# EAGLE schematic 10MHzRefOsc_2V1 (EAGLE 7.7.0)
DF4IAH - 10 MHz Reference Oscillator

## Sheet 1 of 3: Main
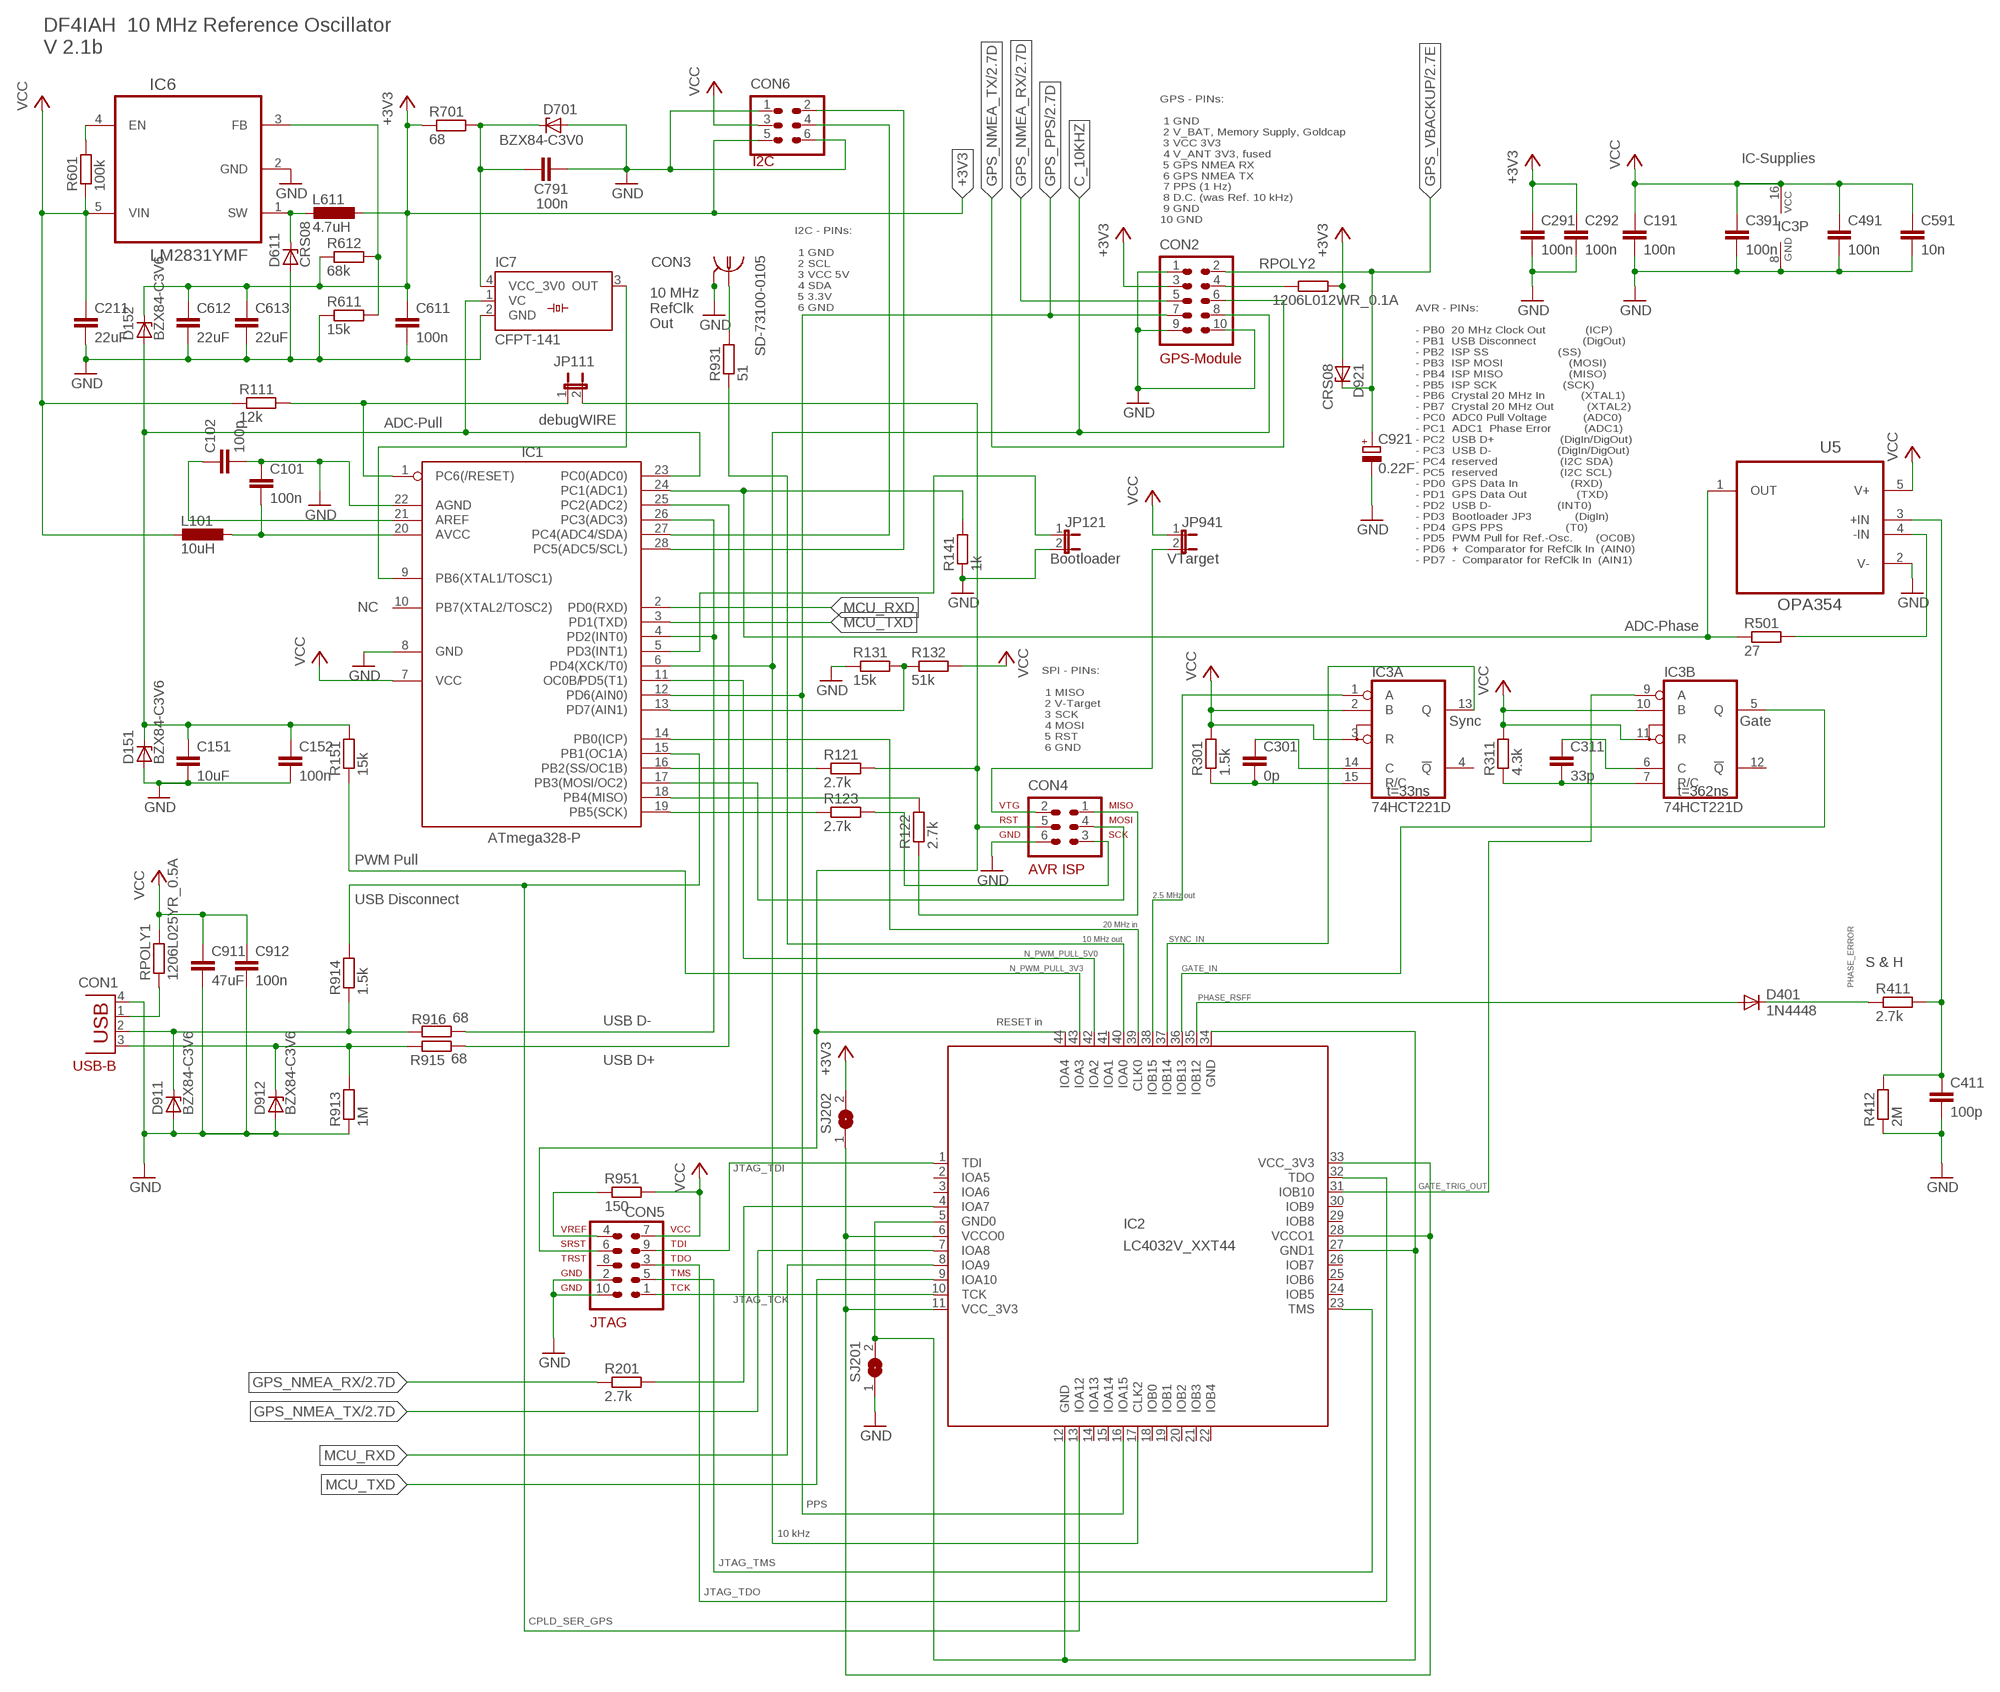
[diagram p0: schematic, sheet 1]

### Parts
C101  100n  C-EUC0805  [C0805]
C102  100p  C-EUC0805  [C0805]
C151  10uF  C-EUC0805  [C0805]
C152  100n  C-EUC0805  [C0805]
C191  100n  C-EUC0805  [C0805]
C211  22uF  C-EUC0805  [C0805]
C291  100n  C-EUC0805  [C0805]
C292  100n  C-EUC0805  [C0805]
C301  0p  C-EUC0805  [C0805]
C311  33p  C-EUC0805  [C0805]
C391  100n  C-EUC0805  [C0805]
C411  100p  C-EUC0805  [C0805]
C491  100n  C-EUC0805  [C0805]
C591  10n  C-EUC0805  [C0805]
C611  100n  C-EUC0805  [C0805]
C612  22uF  C-EUC0805  [C0805]
C613  22uF  C-EUC0805  [C0805]
C791  100n  C-EUC0805  [C0805]
C911  47uF  C-EUC0805  [C0805]
C912  100n  C-EUC0805  [C0805]
C921  0.22F  CPOL-EU140CLH-1010  [140CLH-1010]
CON1  TYCO-AMP_USBUSB-B_SMT  [TYCO-AMP_USB-B_SMT]
CON2  HEADER-2X5SMD  [2X5SMD]
CON3  SD-73100-0105  MOLEX_BNC-JACK-50R_SD-73100-0105  [MOLEX_BNC-JACK-50R_SD-73100-0105]
CON4  AVR-ISP-6SMD  [2X3SMD]
CON5  AVR-JTAG-10SMD  [2X5SMD]
CON6  HEADER-2X3SMD  [2X03SMD]
D151  BZX84-C3V6  BZX84CSMD  [TO236]
D152  BZX84-C3V6  BZX84CSMD  [TO236]
D401  1N4448  DIODE-SOD123  [SOD123]
D611  CRS08  ZENER-DIODESOD80C  [SOD80C]
D701  BZX84-C3V0  BZX84CSMD  [TO236]
D911  BZX84-C3V6  BZX84CSMD  [TO236]
D912  BZX84-C3V6  BZX84CSMD  [TO236]
D921  CRS08  ZENER-DIODESOD80C  [SOD80C]
IC1  ATmega328-P  MEGA8-P  [DIL28-3]
IC2  LC4032V_XXT44  [TQFP44]
IC3  74HCT221D  [SO16]
IC6  LM2831YMF  [SOT95P280X145-5N]
IC7  CFPT-141  [CFPT-141]
JP111  JP1E  [JP1]
JP121  JP1E  [JP1]
JP941  JP1E  [JP1]
L101  10uH  L-EUL1812  [L1812]
L611  4.7uH  L-EUL5650M  [L5650M]
R111  12k  R-EU_R0805  [R0805]
R121  2.7k  R-EU_R0805  [R0805]
R122  2.7k  R-EU_R0805  [R0805]
R123  2.7k  R-EU_R0805  [R0805]
R131  15k  R-EU_R0805  [R0805]
R132  51k  R-EU_R0805  [R0805]
R141  1k  R-EU_R0805  [R0805]
R151  15k  R-EU_R0805  [R0805]
R201  2.7k  R-EU_R0805  [R0805]
R301  1.5k  R-EU_R0805  [R0805]
R311  4.3k  R-EU_R0805  [R0805]
R411  2.7k  R-EU_R0805  [R0805]
R412  2M  R-EU_R0805  [R0805]
R501  27  R-EU_R0805  [R0805]
R601  100k  R-EU_R0805  [R0805]
R611  15k  R-EU_R0805  [R0805]
R612  68k  R-EU_R0805  [R0805]
R701  68  R-EU_R0805  [R0805]
R913  1M  R-EU_R0805  [R0805]
R914  1.5k  R-EU_R0805  [R0805]
R915  68  R-EU_R0805  [R0805]
R916  68  R-EU_R0805  [R0805]
R931  51  R-EU_R0805  [R0805]
R951  150  R-EU_R0805  [R0805]
RPOLY1  1206L025YR_0.5A  R-EU_M1206  [M1206]
RPOLY2  1206L012WR_0.1A  R-EU_M1206  [M1206]
SJ201  SJ  [SJ]
SJ202  SJ  [SJ]
U5  OPA354  [SOT-23-5]

### Nets
+3V0 [N3V3]: C791.1 D701.C IC7.4(VCC_3V0) R701.2
+3V3 [N3V3]: C291.1 C292.1 C611.1 C612.1 C613.1 CON2.3 CON6.5 D152.C D921.A L611.1 R612.1 R701.1 RPOLY2.2 SJ202.2 ; also sheet 2
ADC_PHASE: IC1.24(PC1(ADC1)) R141.2 R501.1 U5.1(OUT)
ADC_PHASE_SAMPLEHOLD: C411.1 R411.2 R412.2 U5.3(+IN)
AIN1: IC1.13(PD7(AIN1)) R131.2 R132.1
AREF: C102.1 IC1.21(AREF)
AVCC: C101.2 IC1.20(AVCC) L101.1
C_2MHZ5: IC2.38(IOB15) IC3.1(A:A)
C_10KHZ: CON2.8 IC1.6(PD4(XCK/T0)) IC2.17(CLK2)
C_10MHZ: IC2.40(IOA0) R931.1
C_20MHZ: IC1.14(PB0(ICP)) IC2.39(CLK0)
CPLD_GPS_NMEA_RX: IC2.4(IOA7) R201.2
EN: IC6.4(EN) R601.2
FB: IC6.3(FB) R611.2 R612.2
GATE_IN: IC2.36(IOB13) IC3.5(B:Q)
GATE_TRIG_OUT: IC2.31(IOB10) IC3.9(B:A)
GND [N0V]: C101.1 C102.2 C151.2 C152.2 C191.2 C211.2 C291.2 C292.2 C391.2 C411.2 C491.2 C591.2 C611.2 C612.2 C613.2 C791.2 C911.2 C912.2 C921.- CON1.4(GND) CON2.1 CON2.9 CON2.10 CON3.2 CON3.3 CON4.6 CON5.2 CON5.10 CON6.1 CON6.6 D151.A D611.A D701.A D911.A D912.A IC1.8(GND) IC1.22(AGND) IC3.8(P:GND) IC6.2(GND) IC7.2(GND) JP121.2 R131.1 R141.1 R412.1 R611.1 R913.1 SJ201.1 U5.2(V-) ; also sheet 2,3
GND_SJ1: IC2.5(GND0) IC2.12(GND) IC2.27(GND1) IC2.34(GND) SJ201.2
GPS_ANT_PWR [N5V]: CON2.4 RPOLY2.1
GPS_NMEA_RX: CON2.5 R201.1 ; also sheet 2
GPS_NMEA_TX: CON2.6 IC2.7(IOA8) ; also sheet 2
GPS_PPS: CON2.7 IC1.12(PD6(AIN0)) IC2.16(IOA15) ; also sheet 2
GPS_VBACKUP: C921.+ CON2.2 D921.C ; also sheet 2
INT1: IC1.5(PD3(INT1)) JP121.1
ISP_MISO: CON4.1 R122.1
ISP_MOSI: CON4.4 IC1.17(PB3(MOSI/OC2))
ISP_SCK: CON4.3 R123.2
ISP_VTARGET: CON4.2 JP941.2
JTAG_SRST: CON4.5 CON5.6 IC2.44(IOA4) JP111.2 R121.2
JTAG_TCK: CON5.1 IC2.10(TCK)
JTAG_TDI: CON5.9 IC2.1(TDI)
JTAG_TDO: CON5.3 IC2.32(TDO)
JTAG_TMS: CON5.5 IC2.23(TMS)
JTAG_VREF: CON5.4 R951.1
MCU_RXD: IC1.2(PD0(RXD)) IC2.8(IOA9)
MCU_TXD: IC1.3(PD1(TXD)) IC2.9(IOA10)
MISO: IC1.18(PB4(MISO)) R122.2
N$1: CON6.2 IC1.28(PC5(ADC5/SCL))
N$3: CON6.4 IC1.27(PC4(ADC4/SDA))
N$42: CON3.1 R931.2
N$44: C311.2 IC3.7(B:R/C) R311.1
N$45: C311.1 IC3.6(B:C)
N$47: C301.2 IC3.15(A:R/C) R301.1
N$48: C301.1 IC3.14(A:C)
N_ADC_PULL: C151.1 C152.1 D151.C D152.A IC1.23(PC0(ADC0)) IC7.1(VC) R151.2
N_PWM_PULL_3V3: IC2.43(IOA3) R151.1
N_PWM_PULL_5V0: IC1.11(PD5(T1)) IC2.42(IOA2)
N_USB_DISC: IC1.15(PB1(OC1A)) IC2.13(IOA12) R914.2
N_USB_DMNS: IC1.4(PD2(INT0)) IC1.26(PC3(ADC3)) R916.2
N_USB_DPLS: IC1.25(PC2(ADC2)) R915.2
PHASE_ERROR: D401.C R411.1
PHASE_RSFF: D401.A IC2.35(IOB12)
RESET: IC1.1(PC6(/RESET)) JP111.1 R111.2
SCK: IC1.19(PB5(SCK)) R123.1
SS: IC1.16(PB2(SS/OC1B)) R121.1
SW [N3V3]: D611.C IC6.1(SW) L611.2
SYNC_IN: IC2.37(IOB14) IC3.13(A:Q)
TOSC1: IC1.9(PB6(XTAL1/TOSC1)) IC7.3(OUT)
U5_FB: R501.2 U5.4(-IN)
USB_D_MIN: CON1.2(D-) D911.C R914.1 R916.1
USB_D_PLS: CON1.3(D+) D912.C R913.2 R915.1
USB_PWR: CON1.1(VBUS) RPOLY1.1
VCC [N5V]: C191.1 C211.1 C391.1 C491.1 C591.1 C911.1 C912.1 CON5.7 CON6.3 IC1.7(VCC) IC3.2(A:B) IC3.3(A:R) IC3.10(B:B) IC3.11(B:R) IC3.16(P:VCC) IC6.5(VIN) JP941.1 L101.2 R111.1 R132.2 R301.2 R311.2 R601.1 R951.2 RPOLY1.2 U5.5(V+)
VCC_3V3_SJ2: IC2.6(VCCO0) IC2.11(VCC_3V3) IC2.28(VCCO1) IC2.33(VCC_3V3) SJ202.1
Unconnected: CON5.8 IC1.10(PB7(XTAL2/TOSC2)) IC2.2(IOA5) IC2.3(IOA6) IC2.14(IOA13) IC2.15(IOA14) IC2.18(IOB0) IC2.19(IOB1) IC2.20(IOB2) IC2.21(IOB3) IC2.22(IOB4) IC2.24(IOB5) IC2.25(IOB6) IC2.26(IOB7) IC2.29(IOB8) IC2.30(IOB9) IC2.41(IOA1) IC3.4(A:!Q) IC3.12(B:!Q)

### Notes on the sheet
- DF4IAH  10 MHz Reference Oscillator
  V 2.1b
- I2C | IC-Supplies
- GPS - PINs:
  
   1 GND
   2 V_BAT, Memory Supply, Goldcap
   3 VCC 3V3
   4 V_ANT 3V3, fused
   5 GPS NMEA RX
   6 GPS NMEA TX
   7 PPS (1 Hz)
   8 D.C. (was Ref. 10 kHz)
   9 GND
  10 GND
- I2C - PINs:
  
   1 GND
   2 SCL
   3 VCC 5V
   4 SDA
   5 3.3V
   6 GND
- 10 MHz
  RefClk
  Out
- GPS-Module
- ADC-Pull | debugWIRE
- Bootloader | VTarget
- AVR - PINs:
  
  - PB0  20 MHz Clock Out            (ICP)
  - PB1  USB Disconnect              (DigOut)
  - PB2  ISP SS                     (SS)
  - PB3  ISP MOSI                    (MOSI)
  - PB4  ISP MISO                    (MISO)
  - PB5  ISP SCK                    (SCK)
  - PB6  Crystal 20 MHz In           (XTAL1)
  - PB7  Crystal 20 MHz Out          (XTAL2)
  - PC0  ADC0 Pull Voltage           (ADC0)
  - PC1  ADC1  Phase Error          (ADC1)
  - PC2  USB D+                    (DigIn/DigOut)
  - PC3  USB D-                    (DigIn/DigOut)
  - PC4  reserved                   (I2C SDA)
  - PC5  reserved                   (I2C SCL)
  - PD0  GPS Data In                (RXD)
  - PD1  GPS Data Out               (TXD)
  - PD2  USB D-                    (INT0)
  - PD3  Bootloader JP3             (DigIn)
  - PD4  GPS PPS                   (T0)
  - PD5  PWM Pull for Ref.-Osc.       (OC0B)
  - PD6  +  Comparator for RefClk In  (AIN0)
  - PD7  -  Comparator for RefClk In  (AIN1)
- NC
- ADC-Phase
- OC0B/
- Sync | Gate
- SPI - PINs:
  
   1 MISO
   2 V-Target
   3 SCK
   4 MOSI
   5 RST
   6 GND
- t=33ns | t=362ns
- PWM Pull
- 2.5 MHz out
- USB Disconnect
- 20 MHz in
- 10 MHz out
- S & H
- USB D- | RESET in
- USB D+
- USB-B
- JTAG_TDI
- JTAG_TCK
- PPS
- 10 kHz
- JTAG_TMS
- JTAG_TDO
- CPLD_SER_GPS

## Sheet 2 of 3: GPS-Unit
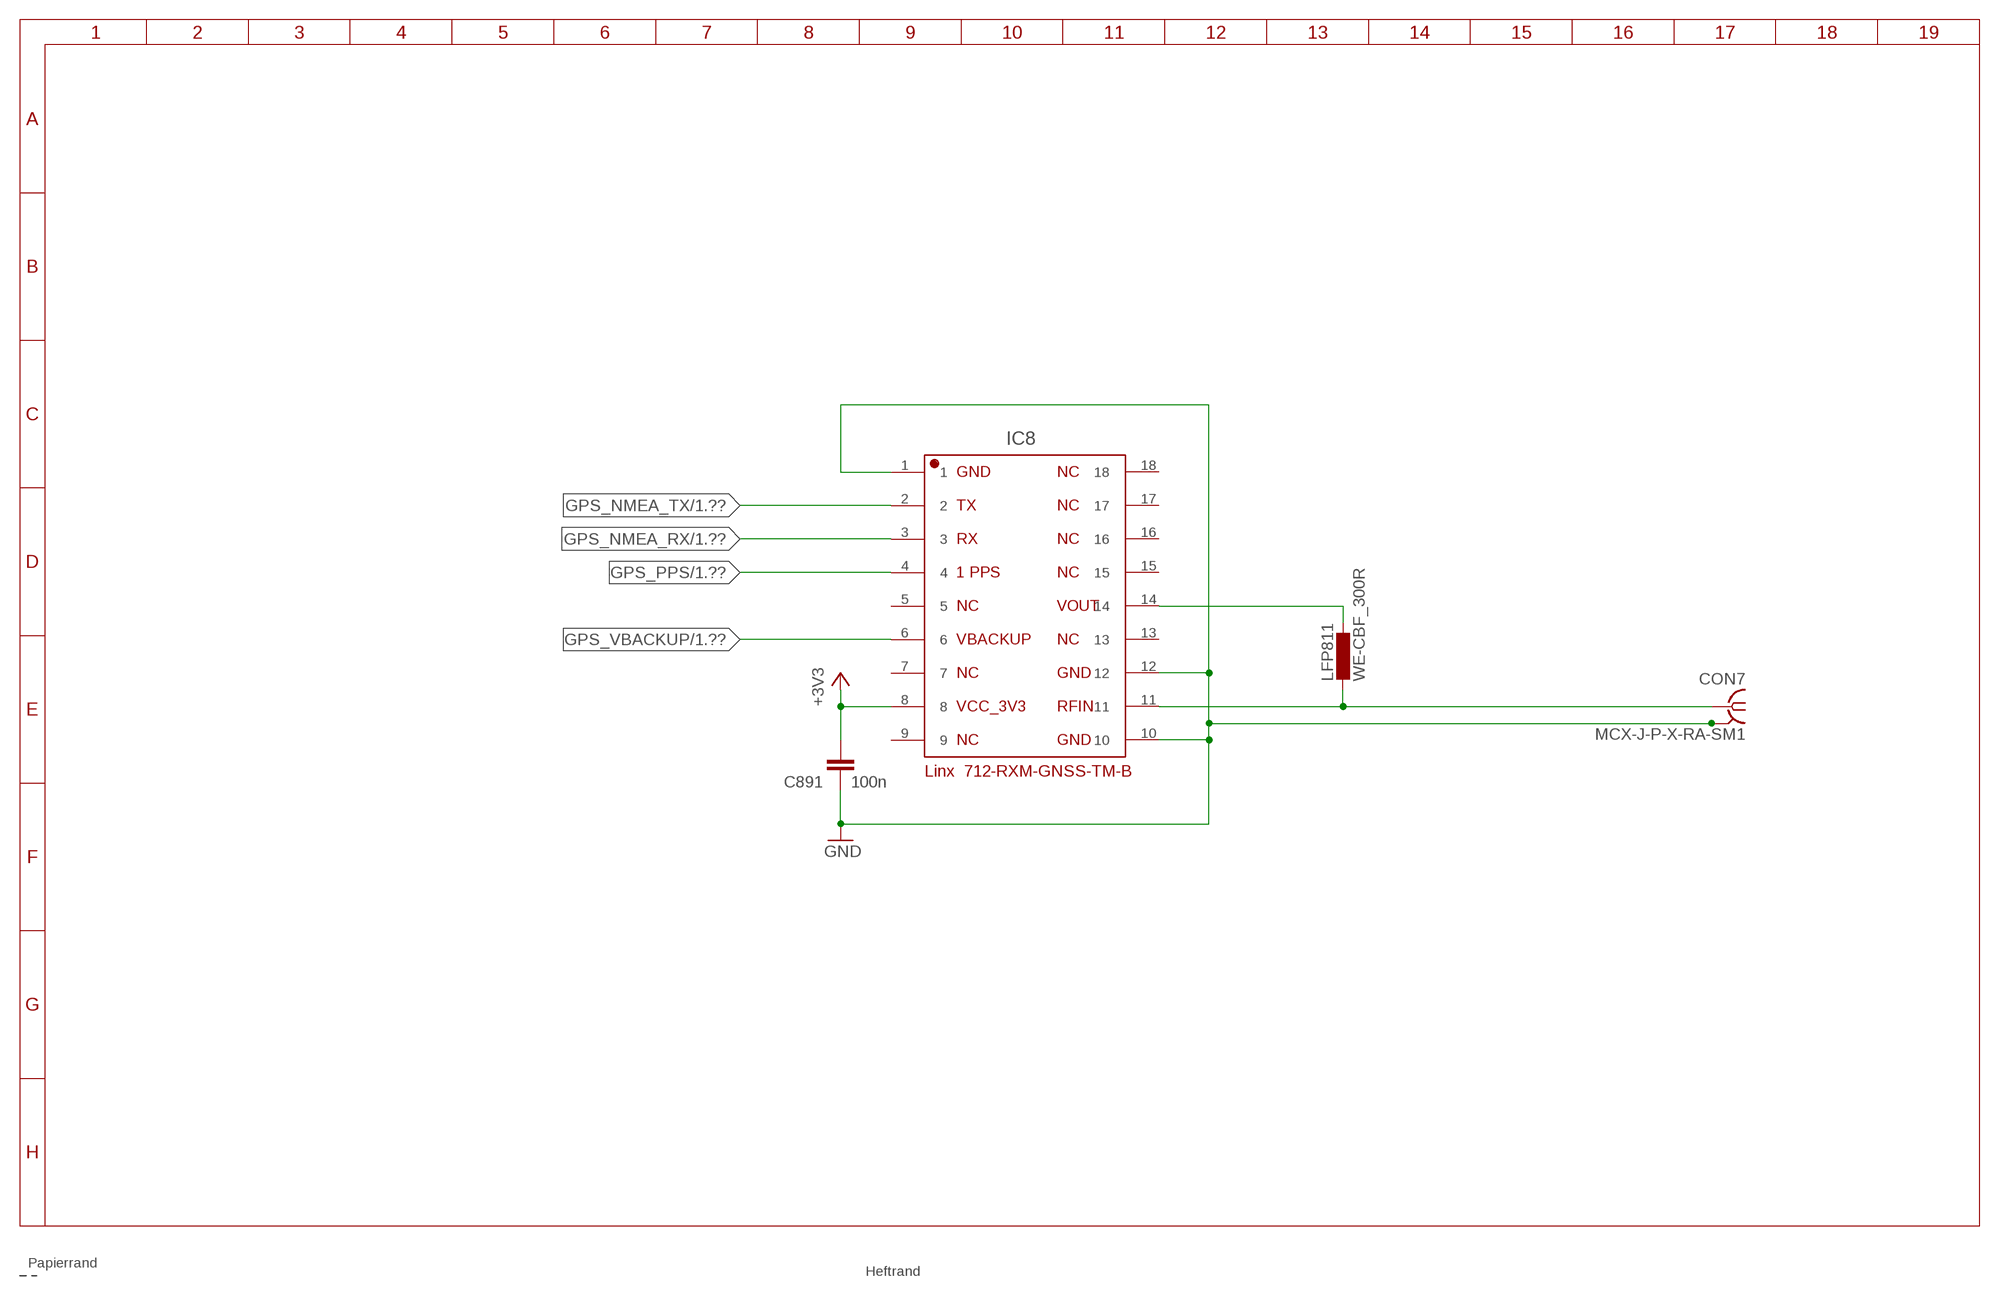
[diagram p1: schematic, sheet 2]

### Parts
C891  100n  C-EUC0805  [C0805]
CON7  MCX-J-P-X-RA-SM1  [MCX-J-P-X-RA-SM1]
IC8  712-RXM-GNSS-TM-B  [712-RXM-GNSS-TM-B]
LFP811  WE-CBF_300R  L-EUL3216C  [L3216C]

### Nets
14: IC8.14 LFP811.1
+3V3 [N3V3]: C891.1 IC8.8 ; also sheet 1
GND [N0V]: C891.2 CON7.2 CON7.3 CON7.4 CON7.5 IC8.1 IC8.10 IC8.12 ; also sheet 1,3
GPS_HF: CON7.1 IC8.11 LFP811.2
GPS_NMEA_RX: IC8.3 ; also sheet 1
GPS_NMEA_TX: IC8.2 ; also sheet 1
GPS_PPS: IC8.4 ; also sheet 1
GPS_VBACKUP: IC8.6 ; also sheet 1
Unconnected: IC8.5 IC8.7 IC8.9 IC8.13 IC8.15 IC8.16 IC8.17 IC8.18

## Sheet 3 of 3: Mount-Pads
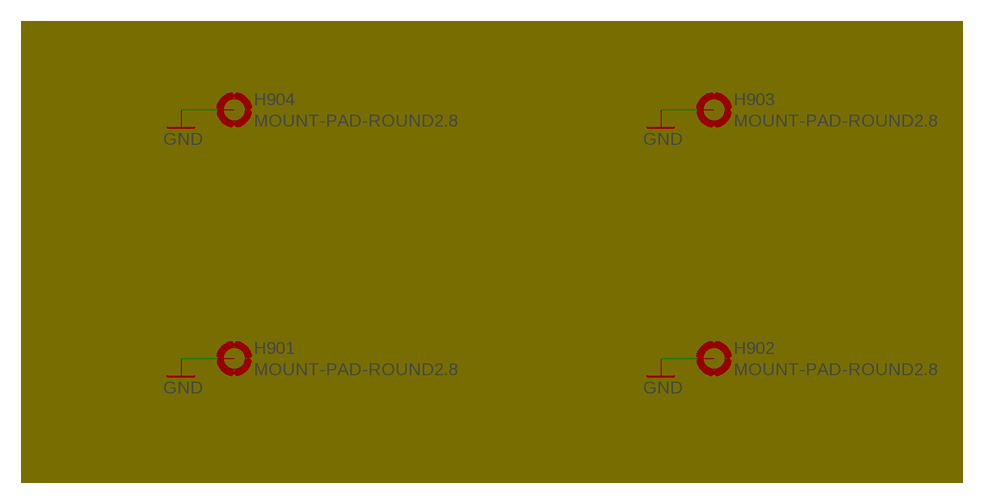
[diagram p2: schematic, sheet 3]

### Parts
H901  MOUNT-PAD-ROUND2.8  [2,8-PAD]
H902  MOUNT-PAD-ROUND2.8  [2,8-PAD]
H903  MOUNT-PAD-ROUND2.8  [2,8-PAD]
H904  MOUNT-PAD-ROUND2.8  [2,8-PAD]

### Nets
GND [N0V]: H901.B2,8(MOUNT) H902.B2,8(MOUNT) H903.B2,8(MOUNT) H904.B2,8(MOUNT) ; also sheet 1,2

## Library data of the parts
C101 C102 C151 C152 C191 C211 C291 C292 C301 C311 C391 C411 C491 C591 C611-C613 C791 C911 C912 = rcl:C-EU: CAPACITOR, European symbol
C891 = df4iah:C-EU: CAPACITOR, European symbol
C921 = rcl:CPOL-EU: POLARIZED CAPACITOR, European symbol
CON1 = df4iah:TYCO-AMP_USB: TYCO-AMP USB-Connectors From Catalog 7-1773422-0 Issued 03-06; MF: TYCO-AMP; MPN: 1734346; OC_FARNELL: 1321918
CON2 = df4iah:HEADER-2X5: Header 2X5 2.54mm ISP, JTAG, ...
CON3 = df4iah:MOLEX_BNC-JACK-50R_SD-73100-0105: MOLEX BNC-Jack 50 Ohm SD-73100-0102; MF: MOLEX; MPN: SD-73100-0105; OC_FARNELL: 1909203; OC_NEWARK: -
CON4 = atmel-1:AVR-ISP-6: AVR ISP-6 Serial Programming Header
CON5 = df4iah:AVR-JTAG-10: AVR JTAG Debug/Programming Header
CON6 = df4iah:HEADER-2X3: Header 2X3 2.54mm ISP, ...
CON7 = df4iah:MCX-J-P-X-RA-SM1: FEMALE SMA CONNECTOR Radiall
D151 D152 D701 D911 D912 = diode:BZX84CSMD: Z DIODE
D401 = diode:DIODE-: DIODE
D611 D921 = diode:ZENER-DIODE: Z-Diode
H901-H904 = holes:MOUNT-PAD-ROUND: MOUNTING PAD, round
IC1 = atmel:MEGA8-P: MICROCONTROLLER 8 Kbytes FLASH 1 kbytes SRAM 512 bytes EEPROM USART 4-channel 10 bit ADC 2-channel 8 bit ADC
IC2 = df4iah:LC4032V_XXT44: bsdliscispmach4032v44pintqfp Auto generated by make-symbol-device-package-bsdl.ulp Rev. 44 Source: bsdliscispmach4032v44pintqfp.BSM Created by: DF4IAH
IC3 = 74xx-eu:74*221: Dual Monostable MULTIVIBRATOR, schmitt trigger inputs
IC6 = df4iah:LM2831: HIGH-EFFICIENCY, SOT23 STEP-DOWN, DC-DC CONVERTER; MPN: LM2831YMF/NOPB; OC_FARNELL: 1286714; OC_NEWARK: -; PACKAGE: SOT-23-5; SUPPLIER: National Semiconductor
IC7 = df4iah:CFPT-141: TCXO, 3.0V; MF: IQD-FREQUENCY-PRODUCTS; MPN: LFTVXO022175; OC_FARNELL: 1100745; OC_NEWARK: -
IC8 = df4iah:712-RXM-GNSS-TM-B: Linx TM-Series 712-RXM-GNSS-TM-B Linx Technologies TM Series GNSS Receiver Module data entry: 2015-01-11 by DF4IAH.
JP111 JP121 JP941 = jumper:JP1E: JUMPER
L101 L611 = rcl:L-EU: INDUCTOR, European symbol
LFP811 = df4iah:L-EU: INDUCTOR, European symbol
R111 R121-R123 R131 R132 R141 R151 R201 R301 R311 R411 R412 R501 R601 R611 R612 R701 R913-R916 R931 R951 RPOLY1 RPOLY2 = rcl:R-EU_: RESISTOR, European symbol
SJ201 SJ202 = jumper:SJ: SMD solder JUMPER
U5 = df4iah_opamp:OPA354: CMOS OPERATIONAL AMPLIFIERS; MPN: OPA354AIDBVT; OC_FARNELL: 1207050; OC_NEWARK: -; PACKAGE: SOT-23-5; SUPPLIER: Texas Instruments

## Net classes
1 N3V3: width 0.508 mm
2 N5V: width 0.508 mm
3 N0V: width 0.508 mm